# EAGLE schematic Netzteil_Darlington_v2 (EAGLE 8.6.3)

## Sheet 1 of 3
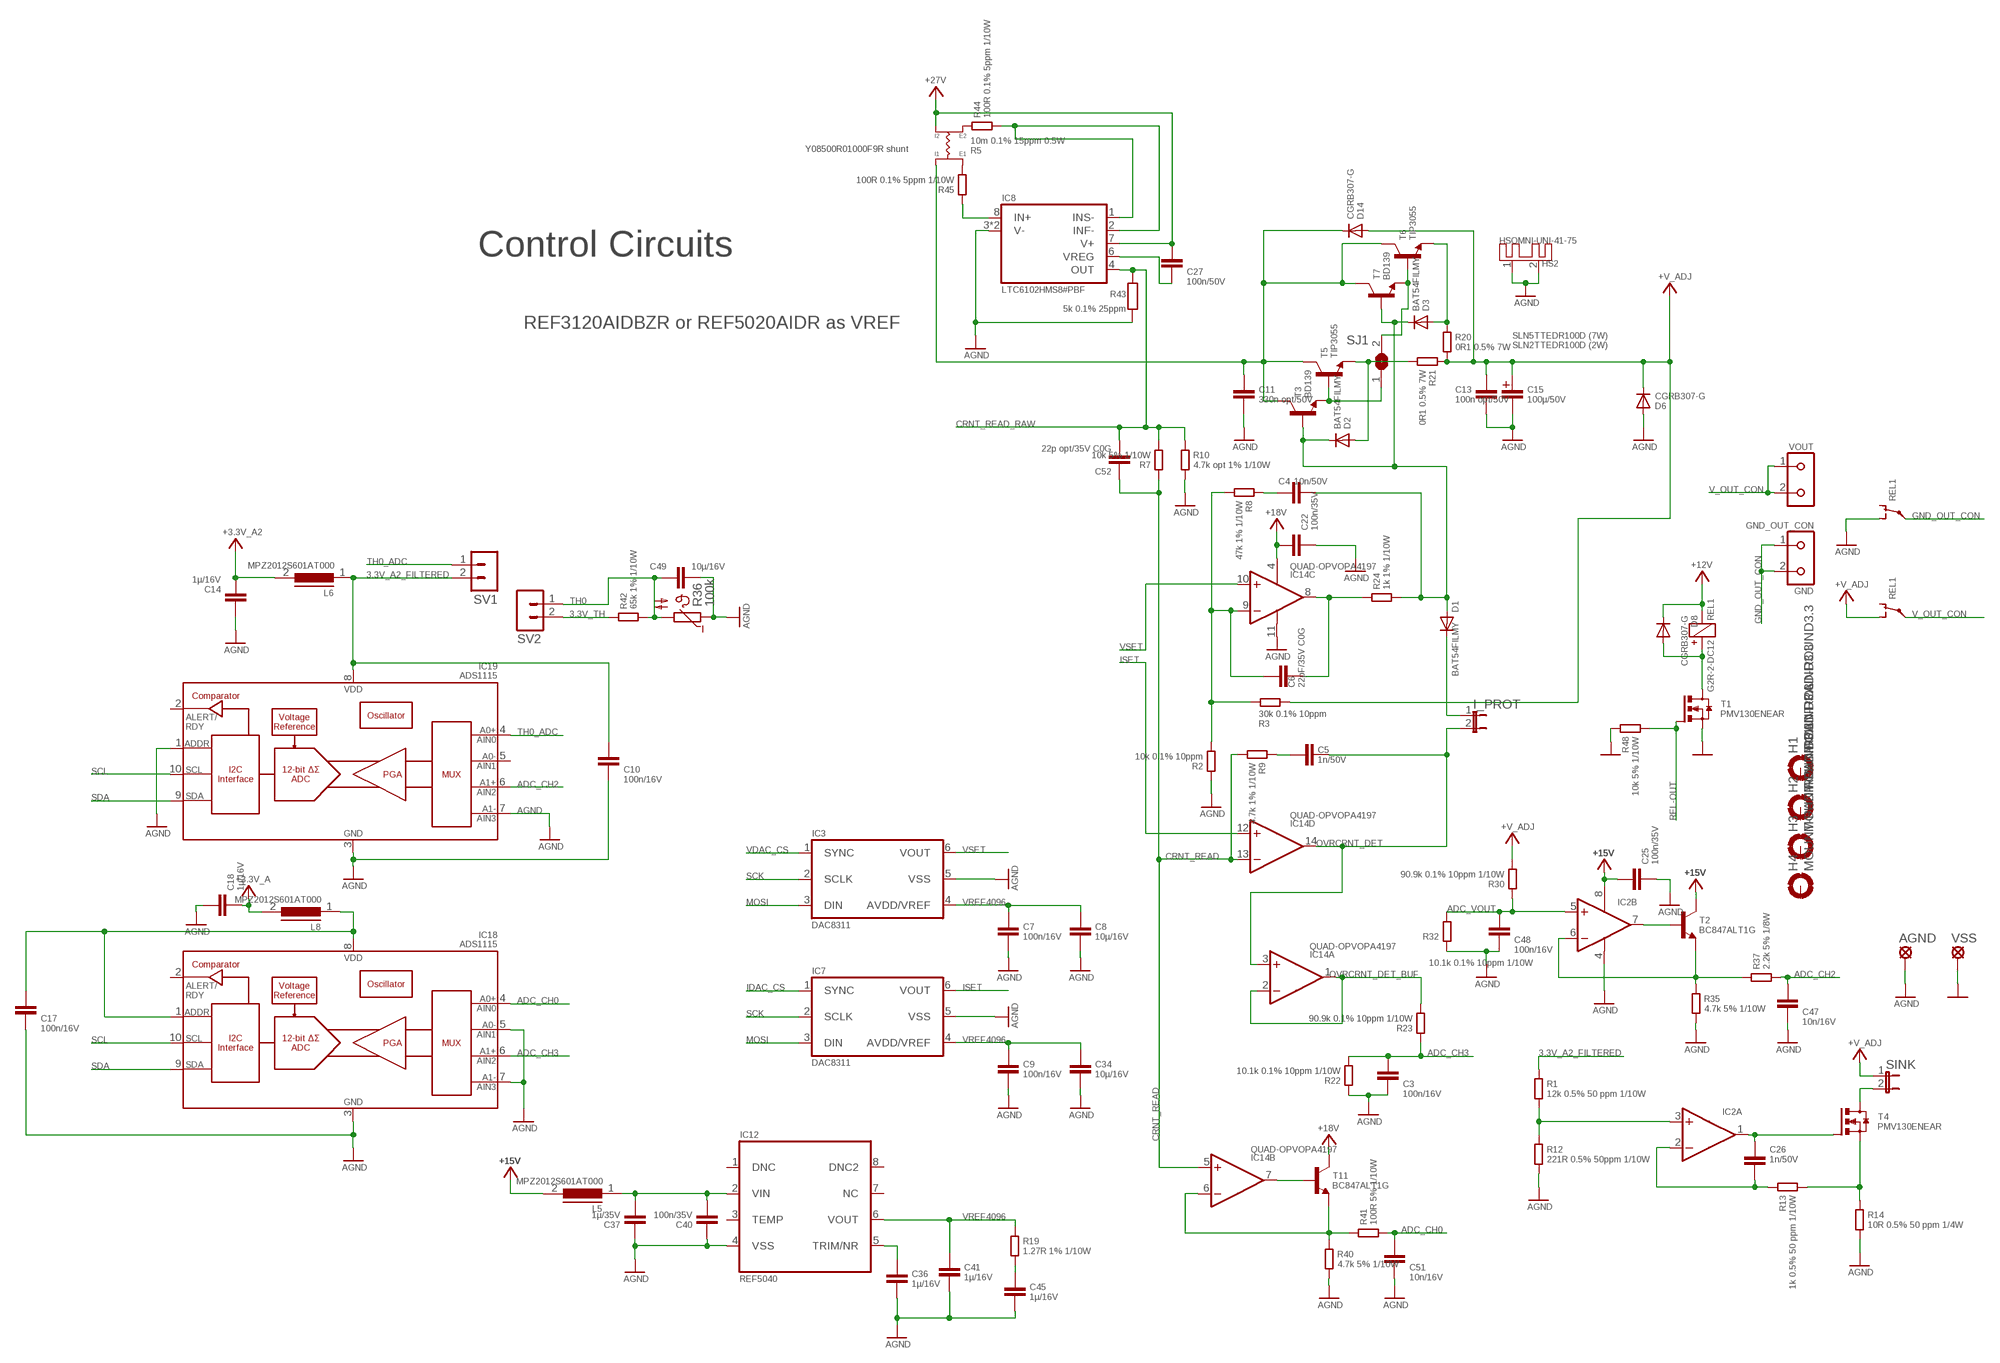
[diagram p0: schematic, sheet 1]

### Parts
AGND  LSP13  [LSP13]
C3  100n/16V  CC/0805  [0805]
C4  10n/50V  CC/0805  [0805]
C5  1n/50V  CC/0805  [0805]
C6  22pF/35V C0G  CC/0805  [0805]
C7  100n/16V  CC/0805  [0805]
C8  10µ/16V  CC/1206  [1206]
C9  100n/16V  CC/0805  [0805]
C10  100n/16V  CC/0805  [0805]
C11  330n opt/50V  CC/0805  [0805]
C13  100n opt/50V  CC/0805  [0805]
C14  1µ/16V  CC/0805  [0805]
C15  100µ/50V  C+3.5/8  [C+/3.5/8]
C17  100n/16V  CC/0805  [0805]
C18  1µ/16V  CC/0805  [0805]
C22  100n/35V  CC/0805  [0805]
C25  100n/35V  CC/0805  [0805]
C26  1n/50V  CC/0805  [0805]
C27  100n/50V  CC/0805  [0805]
C34  10µ/16V  CC/1206  [1206]
C36  1µ/16V  CC/0805  [0805]
C37  1µ/35V  CC/0805  [0805]
C40  100n/35V  CC/0805  [0805]
C41  1µ/16V  CC/0805  [0805]
C45  1µ/16V  CC/0805  [0805]
C47  10n/16V  CC/0805  [0805]
C48  100n/16V  CC/0805  [0805]
C49  10µ/16V  CC/1206  [1206]
C51  10n/16V  CC/0805  [0805]
C52  22p opt/35V C0G  CC/0805  [0805]
D1  BAT54FILMY  DBAT54FILMY  [SOT23]
D2  BAT54FILMY  DBAT54FILMY  [SOT23]
D3  BAT54FILMY  DBAT54FILMY  [SOT23]
D6  CGRB307-G  DWIDE  [DO214AA-CGRB307-G]
D8  CGRB307-G  DWIDE  [DO214AA-CGRB307-G]
D14  CGRB307-G  DWIDE  [DO214AA-CGRB307-G]
GND_OUT_CON  GND  KL2691311500002  [KL2-691311500002]
H1  MOUNT-PAD-ROUND3.3  [3,3-PAD]
H2  MOUNT-PAD-ROUND3.3  [3,3-PAD]
H3  MOUNT-PAD-ROUND3.3  [3,3-PAD]
H4  MOUNT-PAD-ROUND3.3  [3,3-PAD]
HS2  HSOMNI-UNI-41-75  [OMNI-UNI-41-75]
I_PROT  JP1E  [JP1]
IC2  DUAL-OPVSOP8  [SOP8]
IC3  DAC8311  DAC8X11  [SC-70-6]
IC7  DAC8311  DAC8X11  [SC-70-6]
IC8  LTC6102HMS8#PBF  LTC6102  [MSOP8-0.65-3X3MM]
IC12  REF5040  REF50XXVSSOP8  [MSOP8-0.65-3X3MM]
IC14  QUAD-OPVOPA4197  [SO14]
IC18  ADS1115  ADS1015  [MSOP10]
IC19  ADS1115  ADS1015  [MSOP10]
L5  MPZ2012S601AT000  L0805  [C0805K]
L6  MPZ2012S601AT000  L0805  [C0805K]
L8  MPZ2012S601AT000  L0805  [C0805K]
R1  12k 0.5% 50 ppm 1/10W  R-SMD0805  [C0805K]
R2  10k 0.1% 10ppm  R-SMD0805  [C0805K]
R3  30k 0.1% 10ppm  R-SMD0805  [C0805K]
R5  10m 0.1% 15ppm 0.5W  R-CSM2512  [CSM2512]
R7  10k 5% 1/10W  R-SMD0805  [C0805K]
R8  47k 1% 1/10W  R-SMD0805  [C0805K]
R9  4.7k 1% 1/10W  R-SMD0805  [C0805K]
R10  4.7k opt 1% 1/10W  R-SMD0805  [C0805K]
R12  221R 0.5% 50ppm 1/10W  R-SMD0805  [C0805K]
R13  1k 0.5% 50 ppm 1/10W  R-SMD0805  [C0805K]
R14  10R 0.5% 50 ppm 1/4W  R-SMD0805  [C0805K]
R19  1.27R 1% 1/10W  R-SMD0805  [C0805K]
R20  0R1 0.5% 7W  R-SMDSLN2  [SLN2]
R21  0R1 0.5% 7W  R-SMDSLN2  [SLN2]
R22  10.1k 0.1% 10ppm 1/10W  R-SMD0805  [C0805K]
R23  90.9k 0.1% 10ppm 1/10W  R-SMD0805  [C0805K]
R24  1k 1% 1/10W  R-SMD0805  [C0805K]
R30  90.9k 0.1% 10ppm 1/10W  R-SMD0805  [C0805K]
R32  10.1k 0.1% 10ppm 1/10W  R-SMD0805  [C0805K]
R35  4.7k 5% 1/10W  R-SMD0805  [C0805K]
R36  100k  NTC640  [P640]
R37  2.2k 5% 1/8W  R-SMD0805  [C0805K]
R40  4.7k 5% 1/10W  R-SMD0805  [C0805K]
R41  100R 5% 1/10W  R-SMD0805  [C0805K]
R42  65k 1% 1/10W  R-SMD0805  [C0805K]
R43  5k 0.1% 25ppm  R-EU_R1206  [R1206]
R44  100R 0.1% 5ppm 1/10W  R-SMD0805  [C0805K]
R45  100R 0.1% 5ppm 1/10W  R-SMD0805  [C0805K]
R48  10k 5% 1/10W  R-SMD0805  [C0805K]
REL1  G2R-2-DC12  REL-2UG2R2  [REL-G2R2]
SINK  JP1E  [JP1]
SJ1  SJ  [SJ]
SV1  JST-PH-2.0-2P  [JST-PH-2.0-2P]
SV2  JST-PH-2.0-2P  [JST-PH-2.0-2P]
T1  PMV130ENEAR  T-NMOSIRLML2502PBF  [SOT23]
T2  BC847ALT1G  T-NPNSOT23-BEC  [SOT23-BEC]
T3  BD139  T-NPNTO126-ECB  [TO126]
T4  PMV130ENEAR  T-NMOSIRLML2502PBF  [SOT23]
T5  TIP3055  T-NPNTOP3AV-BCE  [TOP3AV]
T6  TIP3055  T-NPNTOP3AV-BCE  [TOP3AV]
T7  BD139  T-NPNTO126-ECB  [TO126]
T11  BC847ALT1G  T-NPNSOT23-BEC  [SOT23-BEC]
VOUT  KL2691311500002  [KL2-691311500002]
VSS  LSP13  [LSP13]

### Nets
3.3V_A2_FILTERED: C10.1 IC19.8(VDD) L6.1 R1.1 SV1.2
3.3V_TH: R42.1 SV2.2
+3.3V_A: C18.2 L8.2 ; also sheet 2
+3.3V_A2: C14.2 L6.2 ; also sheet 2
+12V: D8.C REL1.-(1:-) ; also sheet 2,3
+15V: C25.1 IC2.8(PWR:V+) L5.2 T2.C ; also sheet 2
+18V: C22.1 IC14.4(PWR:V+) T11.C ; also sheet 2
+27V: C27.1 IC8.7(V+) R5.I2 ; also sheet 2
+V_ADJ: C13.1 C15.+ D6.C D14.A R3.1 R20.2 R21.1 R30.2 REL1.S1(2:S) SINK.1
ADC_CH0: C51.1 IC18.4(AIN0) R41.2
ADC_CH2: C47.1 IC19.6(AIN2) R37.2
ADC_CH3: C3.1 IC18.6(AIN2) R22.2 R23.1
ADC_VOUT: C48.1 IC2.5(B:+IN) R30.1 R32.2
AGND: AGND.MP C3.2 C7.2 C8.2 C9.2 C10.2 C11.2 C13.2 C14.1 C15.- C17.2 C18.1 C22.2 C25.2 C34.2 C36.2 C37.1 C40.1 C41.2 C45.2 C47.2 C48.2 C49.1 C51.2 D6.A HS2.1 HS2.2 IC2.4(PWR:V-) IC3.5(VSS) IC7.5(VSS) IC8.3(V-) IC8.5(V-) IC12.4(VSS) IC14.11(PWR:V-) IC18.3(VSS) IC18.5(AIN1) IC18.7(AIN3) IC19.1(ADDR) IC19.3(VSS) IC19.7(AIN3) R2.1 R10.2 R12.2 R14.2 R22.1 R32.1 R35.2 R36.1 R40.2 R43.1 REL1.S2(3:S) ; also sheet 2,3
CRNT_READ: C52.1 IC14.5(B:+IN) IC14.13(D:-IN) R7.1 R9.2
CRNT_READ_RAW: C52.2 IC8.4(OUT) R7.2 R10.1 R43.2
GND_OUT_CON: GND_OUT_CON.1 GND_OUT_CON.2 REL1.P2(3:P)
IDAC_CS: IC7.1(SYNC) ; also sheet 3
ISET: IC7.6(VOUT) IC14.12(D:+IN)
MOSI: IC3.3(DIN) IC7.3(DIN) ; also sheet 3
N$3: C11.1 D14.C R5.I1 T3.2(C) T5.C T6.C T7.2(C)
N$4: D3.1(A) R20.1 T6.E
N$5: SJ1.2 T6.B T7.1(E)
N$6: IC14.7(B:OUT) T11.B
N$8: D2.1(A) R21.2 T5.E
N$10: D1.3(C) I_PROT.1
N$11: IC2.3(A:+IN) R1.2 R12.1
N$14: C36.1 IC12.5(TRIM/NR)
N$15: SJ1.1 T3.1(E) T5.B
N$16: R13.2 R14.1 T4.2(S)
N$18: C26.2 IC2.2(A:-IN) R13.1
N$19: IC2.7(B:OUT) T2.B
N$21: C6.2 IC14.8(C:OUT) R24.1
N$22: C4.2 D1.1(A) D2.3(C) D3.3(C) R24.2 T3.3(B) T7.3(B)
N$24: C17.1 IC18.1(ADDR) IC18.8(VDD) L8.1
N$25: C37.2 C40.2 IC12.2(VIN) L5.1
N$27: C4.1 R8.1
N$28: C5.1 R9.1
N$31: C6.1 IC14.9(C:-IN) R2.2 R3.2 R8.2
N$32: C45.1 R19.2
N$33: C26.1 IC2.1(A:OUT) T4.1(G)
N$34: SINK.2 T4.3(D)
N$38: D8.A REL1.+(1:+) T1.3(D)
N$41: IC2.6(B:-IN) R35.1 R37.1 T2.E
N$45: IC14.6(B:-IN) R40.1 R41.1 T11.E
N$47: IC8.8(IN+) R45.1
N$49: IC8.1(INS-) IC8.2(INF-) R44.2
N$50: C27.2 IC8.6(VREG)
N$51: R5.E2 R44.1
N$52: R5.E1 R45.2
OVRCRNT_DET: C5.2 I_PROT.2 IC14.3(A:+IN) IC14.14(D:OUT)
OVRCRNT_DET_BUF: IC14.1(A:OUT) IC14.2(A:-IN) R23.2
REL-OUT: R48.2 T1.1(G) ; also sheet 3
SCK: IC3.2(SCLK) IC7.2(SCLK) ; also sheet 3
SCL: IC18.10(SCL) IC19.10(SCL) ; also sheet 3
SDA: IC18.9(SDA) IC19.9(SDA) ; also sheet 3
TH0: C49.2 R36.2 R42.2 SV2.1
TH0_ADC: IC19.4(AIN0) SV1.1
V_OUT_CON: REL1.P1(2:P) VOUT.1 VOUT.2
VDAC_CS: IC3.1(SYNC) ; also sheet 3
VREF4096: C7.1 C8.1 C9.1 C34.1 C41.1 IC3.4(AVDD/VREF) IC7.4(AVDD/VREF) IC12.6(VOUT) R19.1
VSET: IC3.6(VOUT) IC14.10(C:+IN)
VSS: R48.1 T1.2(S) VSS.MP ; also sheet 2,3
Unconnected: H1.B3,3(MOUNT) H2.B3,3(MOUNT) H3.B3,3(MOUNT) H4.B3,3(MOUNT) IC12.1(DNC) IC12.3(TEMP) IC12.7(NC) IC12.8(DNC2) IC18.2(ALERT/RDY) IC19.2(ALERT/RDY) IC19.5(AIN1) REL1.O1(2:O) REL1.O2(3:O)

### Notes on the sheet
- Y08500R01000F9R shunt
- Control Circuits
- REF3120AIDBZR or REF5020AIDR as VREF
- SLN5TTEDR100D (7W)
  SLN2TTEDR100D (2W)

## Sheet 2 of 3
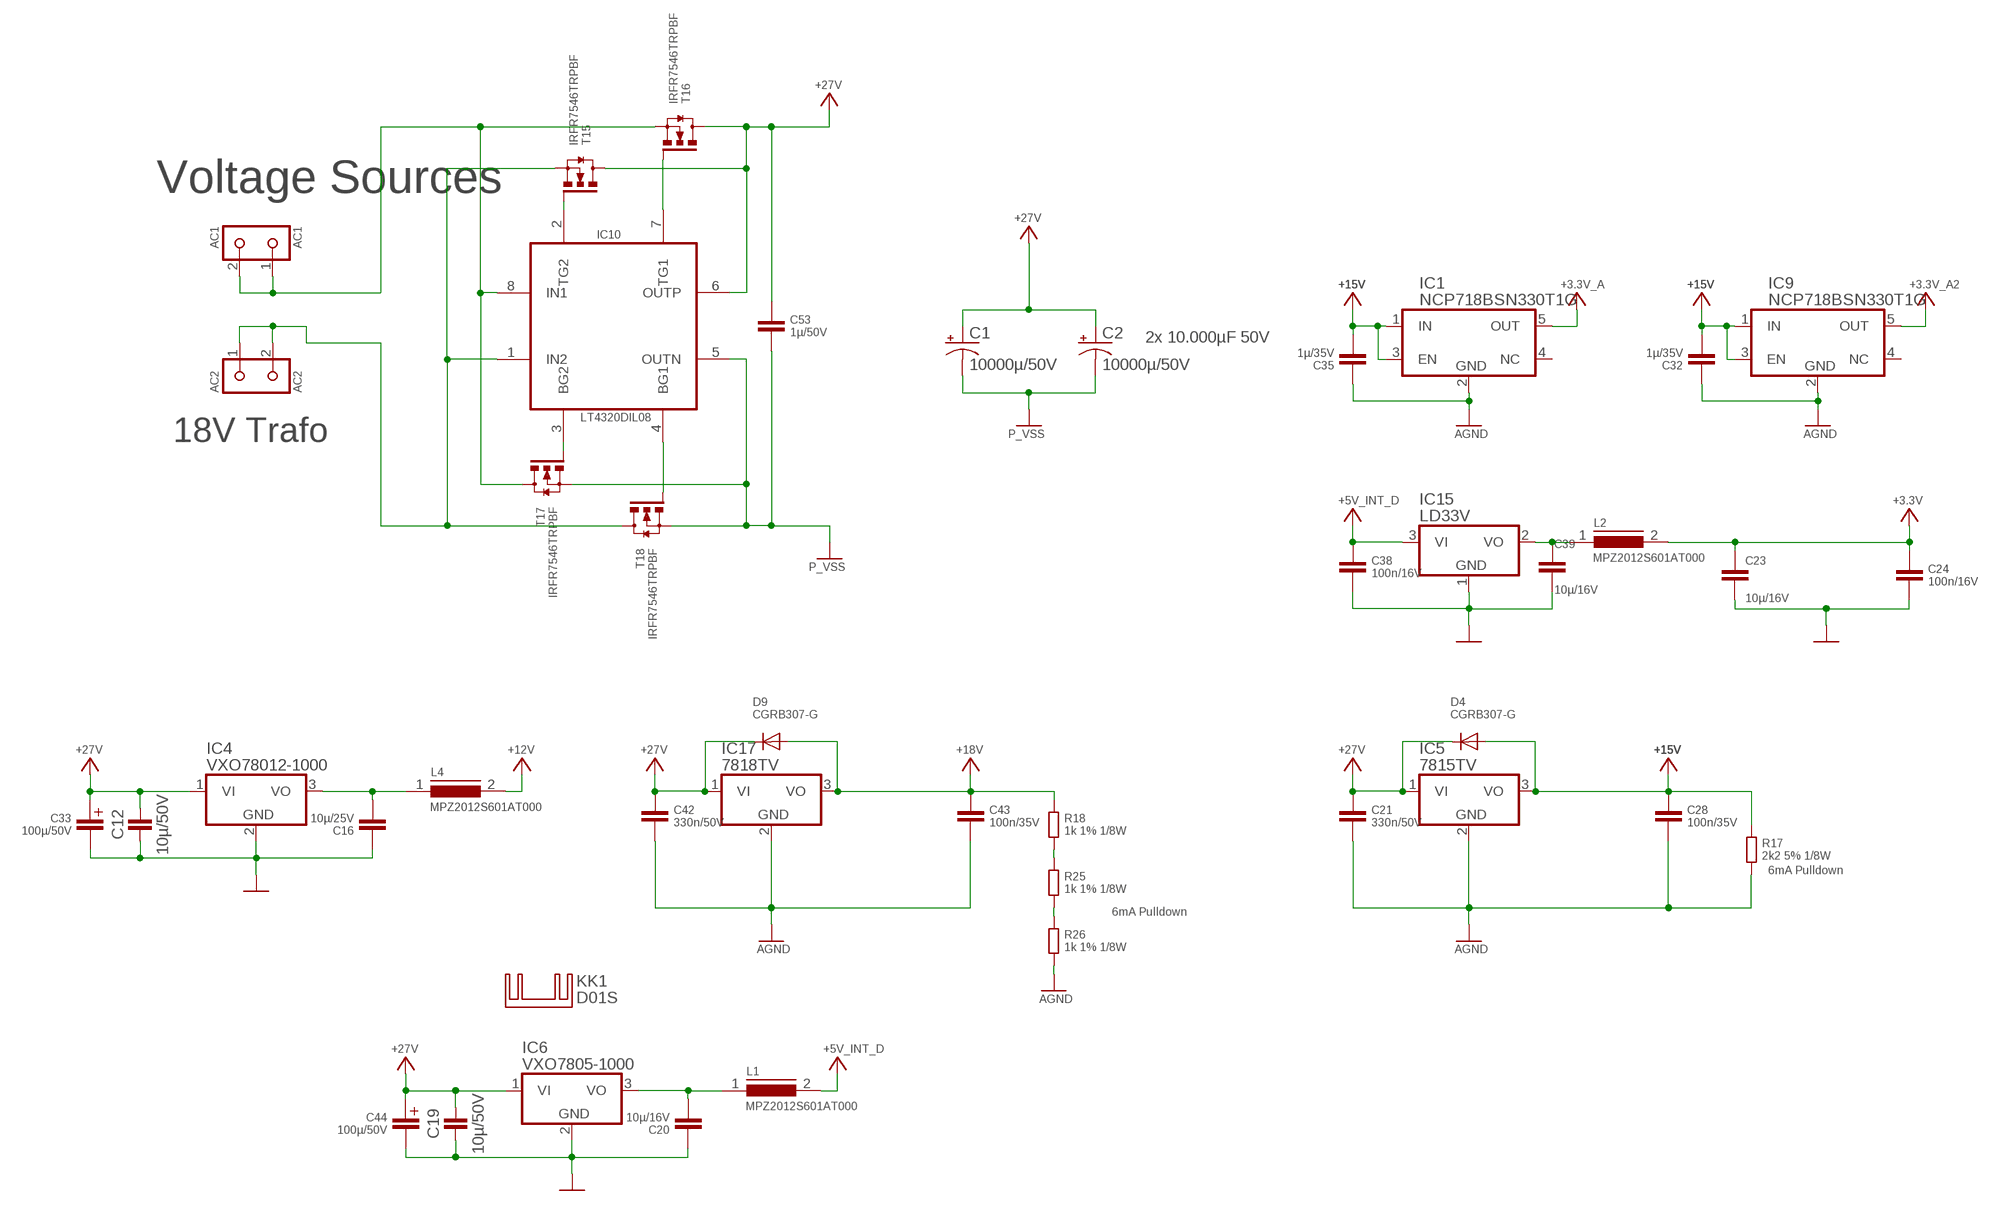
[diagram p1: schematic, sheet 2]

### Parts
AC1  AC1  KL2691311500002  [KL2-691311500002]
AC2  AC2  KL2691311500002  [KL2-691311500002]
C1  10000µ/50V  CPOL-USE10-22.5  [EB22,5D]
C2  10000µ/50V  CPOL-USE10-22.5  [EB22,5D]
C12  10µ/50V  CAPACITOR-1210  [C1210]
C16  10µ/25V  CC/1206  [1206]
C19  10µ/50V  CAPACITOR-1210  [C1210]
C20  10µ/16V  CC/1206  [1206]
C21  330n/50V  CC/0805  [0805]
C23  10µ/16V  CC/1206  [1206]
C24  100n/16V  CC/0805  [0805]
C28  100n/35V  CC/0805  [0805]
C32  1µ/35V  CC/0805  [0805]
C33  100µ/50V  C+3.5/8  [C+/3.5/8]
C35  1µ/35V  CC/0805  [0805]
C38  100n/16V  CC/0805  [0805]
C39  10µ/16V  CC/1206  [1206]
C42  330n/50V  CC/0805  [0805]
C43  100n/35V  CC/0805  [0805]
C44  100µ/50V  C+3.5/8  [C+/3.5/8]
C53  1µ/50V  CC/1206  [1206]
D4  CGRB307-G  DWIDE  [DO214AA-CGRB307-G]
D9  CGRB307-G  DWIDE  [DO214AA-CGRB307-G]
IC1  NCP718BSN330T1G  NCP718  [SOT23-5]
IC4  VXO78012-1000  78XX-DC-DC-UNI-VXO-OKI  [78XX-DC-DC]
IC5  7815TV  [TO220V]
IC6  VXO7805-1000  78XX-DC-DC-UNI-VXO-OKI  [78XX-DC-DC]
IC9  NCP718BSN330T1G  NCP718  [SOT23-5]
IC10  LT4320DIL08  [DIL08]
IC15  LD33V  [TO220V]
IC17  7818TV  [TO220V]
KK1  D01S  [D01S]
L1  MPZ2012S601AT000  L0805  [C0805K]
L2  MPZ2012S601AT000  L0805  [C0805K]
L4  MPZ2012S601AT000  L0805  [C0805K]
R17  2k2 5% 1/8W  R-SMD0805  [C0805K]
R18  1k 1% 1/8W  R-SMD0805  [C0805K]
R25  1k 1% 1/8W  R-SMD0805  [C0805K]
R26  1k 1% 1/8W  R-SMD0805  [C0805K]
T15  IRFR7546TRPBF  T-NMOSNTD4963N  [DPACK]
T16  IRFR7546TRPBF  T-NMOSNTD4963N  [DPACK]
T17  IRFR7546TRPBF  T-NMOSNTD4963N  [DPACK]
T18  IRFR7546TRPBF  T-NMOSNTD4963N  [DPACK]

### Nets
+3.3V: C23.1 C24.1 L2.2 ; also sheet 3
+3.3V_A: IC1.5(OUT) ; also sheet 1
+3.3V_A2: IC9.5(OUT) ; also sheet 1
+5V_INT_D: C38.1 IC15.3(VI) L1.2 ; also sheet 3
+12V: L4.2 ; also sheet 1,3
+15V: C28.1 C32.2 C35.2 D4.A IC1.1(IN) IC1.3(EN) IC5.3(VO) IC9.1(IN) IC9.3(EN) R17.1 ; also sheet 1
+18V: C43.1 D9.A IC17.3(VO) R18.1 ; also sheet 1
+27V: C1.+ C2.+ C12.2 C19.2 C21.1 C33.+ C42.1 C44.+ C53.1 D4.C D9.C IC4.1(VI) IC5.1(VI) IC6.1(VI) IC10.6(OUTP) IC17.1(VI) T15.3(D) T16.3(D) ; also sheet 1
AGND: C21.2 C28.2 C32.1 C35.1 C42.2 C43.2 IC1.2(GND) IC5.2(GND) IC9.2(GND) IC17.2(GND) R17.2 R26.2 ; also sheet 1,3
N$1: C20.2 IC6.3(VO) L1.1
N$2: AC2.1 AC2.2 IC10.1(IN2) T15.2(S) T18.3(D)
N$13: C16.2 IC4.3(VO) L4.1
N$26: R18.2 R25.1
N$30: R25.2 R26.1
N$35: C39.2 IC15.2(VO) L2.1
N$53: IC10.2(TG2) T15.1(G)
N$54: IC10.3(BG2) T17.1(G)
N$55: IC10.7(TG1) T16.1(G)
N$56: IC10.4(BG1) T18.1(G)
N$57: AC1.1 AC1.2 IC10.8(IN1) T16.2(S) T17.3(D)
P_VSS: C1.- C2.- C53.2 IC10.5(OUTN) T17.2(S) T18.2(S)
VSS: C12.1 C16.1 C19.1 C20.1 C23.2 C24.2 C33.- C38.2 C39.1 C44.- IC4.2(GND) IC6.2(GND) IC15.1(GND) ; also sheet 1,3
Unconnected: IC1.4(NC) IC9.4(NC)

### Notes on the sheet
- Voltage Sources
- 2x 10.000µF 50V
- 18V Trafo
- 6mA Pulldown
- 6mA Pulldown

## Sheet 3 of 3
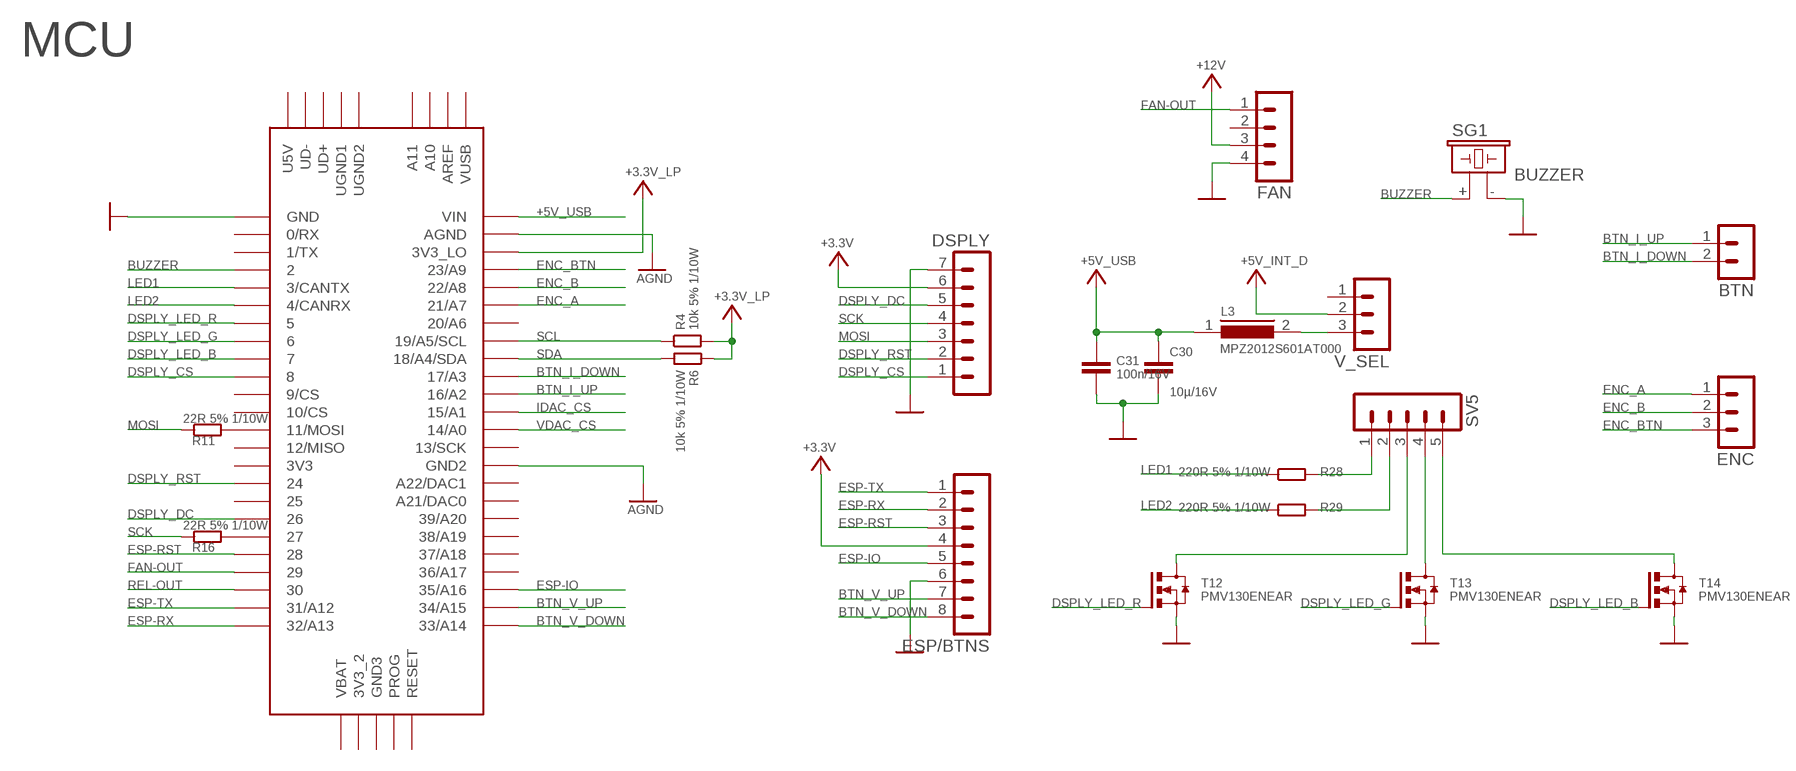
[diagram p2: schematic, sheet 3]

### Parts
BTN  JST-PH-2.0-2P  [JST-PH-2.0-2P]
C30  10µ/16V  CC/1206  [1206]
C31  100n/16V  CC/0805  [0805]
DSPLY  JST-PH-2.0-7P  [JST-PH-2.0-7P]
ENC  JST-PH-2.0-3P  [JST-PH-2.0-3P]
ESP/BTNS  JST-PH-2.0-8P  [JST-PH-2.0-8P]
FAN  JST-PH-2.0-4P  [JST-PH-2.0-4P]
L3  MPZ2012S601AT000  L0805  [C0805K]
R4  10k 5% 1/10W  R-SMD0805  [C0805K]
R6  10k 5% 1/10W  R-SMD0805  [C0805K]
R11  22R 5% 1/10W  R-SMD0805  [C0805K]
R16  22R 5% 1/10W  R-SMD0805  [C0805K]
R28  220R 5% 1/10W  R-SMD0805  [C0805K]
R29  220R 5% 1/10W  R-SMD0805  [C0805K]
SG1  BUZZER  [254-EMB73-RO]
SV5  JST-PH-2.0-5P  [JST-PH-2.0-5P]
T12  PMV130ENEAR  T-NMOSIRLML2502PBF  [SOT23]
T13  PMV130ENEAR  T-NMOSIRLML2502PBF  [SOT23]
T14  PMV130ENEAR  T-NMOSIRLML2502PBF  [SOT23]
U$33  TEENSY_3.5/3.6  [TEENSY_3.5/3.6]
V_SEL  MA03-1  [MA03-1]

### Nets
+3.3V: DSPLY.6 ESP/BTNS.4 ; also sheet 2
+3.3V_LP: R4.2 R6.1 U$33.3V3_LO
+5V_INT_D: V_SEL.2 ; also sheet 2
+5V_USB: C30.1 C31.1 L3.1 U$33.VIN
+12V: FAN.3 ; also sheet 1,2
AGND: U$33.AGND U$33.GND2 ; also sheet 1,2
BTN_I_DOWN: BTN.2 U$33.17/A3
BTN_I_UP: BTN.1 U$33.16/A2
BTN_V_DOWN: ESP/BTNS.8 U$33.33/A14
BTN_V_UP: ESP/BTNS.7 U$33.34/A15
BUZZER: SG1.+ U$33.2
DSPLY_CS: DSPLY.1 U$33.8
DSPLY_DC: DSPLY.5 U$33.26
DSPLY_LED_B: T14.1(G) U$33.7
DSPLY_LED_G: T13.1(G) U$33.6
DSPLY_LED_R: T12.1(G) U$33.5
DSPLY_RST: DSPLY.2 U$33.24
ENC_A: ENC.1 U$33.21/A7
ENC_B: ENC.2 U$33.22/A8
ENC_BTN: ENC.3 U$33.23/A9
ESP-IO: ESP/BTNS.5 U$33.35/A16
ESP-RST: ESP/BTNS.3 U$33.28
ESP-RX: ESP/BTNS.2 U$33.32/A13
ESP-TX: ESP/BTNS.1 U$33.31/A12
FAN-OUT: FAN.1 U$33.29
IDAC_CS: U$33.15/A1 ; also sheet 1
LED1: R28.1 U$33.3/CANTX
LED2: R29.1 U$33.4/CANRX
MOSI: DSPLY.3 R11.1 ; also sheet 1
N$7: SV5.3 T12.3(D)
N$9: R16.2 U$33.27
N$17: R11.2 U$33.11/MOSI
N$20: R28.2 SV5.1
N$23: R29.2 SV5.2
N$36: L3.2 V_SEL.3
N$46: SV5.4 T13.3(D)
N$48: SV5.5 T14.3(D)
REL-OUT: U$33.30 ; also sheet 1
SCK: DSPLY.4 R16.1 ; also sheet 1
SCL: R4.1 U$33.19/A5/SCL ; also sheet 1
SDA: R6.2 U$33.18/A4/SDA ; also sheet 1
VDAC_CS: U$33.14/A0 ; also sheet 1
VSS: C30.2 C31.2 DSPLY.7 ESP/BTNS.6 FAN.4 SG1.- T12.2(S) T13.2(S) T14.2(S) U$33.GND ; also sheet 1,2
Unconnected: FAN.2 U$33.0/RX U$33.1/TX U$33.3V3 U$33.3V3_2 U$33.9/CS U$33.10/CS U$33.12/MISO U$33.13/SCK U$33.20/A6 U$33.21/DAC0(A21/DAC0) U$33.25 U$33.36/A17 U$33.37/A18 U$33.38/A19 U$33.39/A20 U$33.A10 U$33.A11 U$33.A22/DAC1 U$33.AREF U$33.GND3 U$33.PROG U$33.RESET U$33.U5V U$33.UD+ U$33.UD- U$33.UGND1 U$33.UGND2 U$33.VBAT U$33.VUSB V_SEL.1

### Notes on the sheet
- MCU

## Library data of the parts
AC1 = neumluc:KL2: Printklemme 2-polig; OC_MOUSER: 710-691311500002; OC_MOUSER_ADD: 693-8601.2001.08; OC_MOUSER_ADD2: 693-3101.0010
AC2 = neumluc:KL2: Printklemme 2-polig; OC_MOUSER: 710-691311500002; OC_MOUSER_ADD: 693-8601.2001.08
AGND VSS = solpad:LSP13: SOLDER PAD drill 1.3 mm, distributor Buerklin, 12H562
BTN SV1 SV2 = neumluc:JST-PH-2.0-2P: PIN HEADER
C1 C2 = neumluc:CPOL-US: POLARIZED CAPACITOR, American symbol; OC_MOUSER: 647-UVZ1H103MRD
C3 C7 C9 C10 C13 C17 C22 C24 C25 C27 C28 C31 C38 C40 C43 C48 = goujine:C: Kondensator; OC_MOUSER: 810-C2012X7R2A104K
C4 C47 C51 = goujine:C: Kondensator; OC_MOUSER: 80-C0805C103K1R
C5 C26 = goujine:C: Kondensator; OC_MOUSER: 603-CC805KRX7R0BB102
C6 C52 = goujine:C: Kondensator; OC_MOUSER: 603-CC805JRNPO9BN220
C8 C16 C20 C23 C30 C34 C39 C49 = goujine:C: Kondensator; OC_MOUSER: 963-TMK316AB7106KL-T
C11 C21 C42 = goujine:C: Kondensator; OC_MOUSER: 80-C0805C334K5RECTU
C12 C19 = we-rcl:CAPACITOR: Capacitors ...2.2uF @ 6.3V -> 0402 ...4.7uF @ 6.3V -> 0603 ...10uF @ 16V -> 0805 ...22uF @ 25V -> 1206; OC_MOUSER: 81-GRM32ER71H106MA2L
C14 C18 C32 C35-C37 C41 C45 = goujine:C: Kondensator; OC_MOUSER: 963-UMK212B7105KG-T
C15 C33 C44 = goujine:C+; OC_MOUSER: 667-EEU-FR1H101
C53 = goujine:C: Kondensator; OC_MOUSER: 603-CC126KKX7R9BB105
D1-D3 = neumluc:D; OC_MOUSER: 511-BAT54FILMY
D4 D6 D8 D9 D14 = neumluc:D; OC_MOUSER: 750-CGRB307-G
DSPLY = neumluc:JST-PH-2.0-7P: PIN HEADER
ENC = neumluc:JST-PH-2.0-3P: PIN HEADER
ESP/BTNS = neumluc:JST-PH-2.0-8P: PIN HEADER
FAN = neumluc:JST-PH-2.0-4P: PIN HEADER
GND_OUT_CON = neumluc:KL2: Printklemme 2-polig; OC_MOUSER: 710-691311500002
H1-H4 = holes:MOUNT-PAD-ROUND: MOUNTING PAD, round
HS2 = neumluc:HS; OC_MOUSER: 567-OMNI-UNI-41-75; OC_MOUSER_ADD: 567-OMNI-UC; OC_MOUSER_ADD2: 567-CD-02-05-247
I_PROT SINK = jumper:JP1E: JUMPER
IC1 IC9 = neumluc:NCP718; OC_MOUSER: 863-NCP718BSN330T1G
IC2 = goujine:DUAL-OPV
IC3 IC7 = neumluc:DAC8X11; OC_MOUSER: 595-DAC8311IDCKR
IC4 = neumluc:78XX-DC-DC-UNI-VXO-OKI; OC_MOUSER: 490-VXO7812-1000
IC5 = linear:78*: Positive VOLTAGE REGULATOR Source: http://cache.national.com/ds/LM/LM78L05.pdf http://www.fairchildsemi.com/ds/LM/LM7805.pdf; OC_MOUSER: 511-L7815CV-DG
IC6 = neumluc:78XX-DC-DC-UNI-VXO-OKI; OC_MOUSER: 490-VXO7805-1000
IC8 = neumluc:LTC6102; OC_MOUSER: 584-LTC6102HMS8#PBF
IC10 = neumluc:LT4320; OC_MOUSER: 584-LT4320HN8-1#PBF
IC12 = neumluc:REF50XX; OC_MOUSER: 595-REF5040AIDGKR
IC14 = neumluc:QUAD-OPV
IC15 = neumluc:LD33V; OC_MOUSER: 511-LD1117V33
IC17 = linear:78*: Positive VOLTAGE REGULATOR Source: http://cache.national.com/ds/LM/LM78L05.pdf http://www.fairchildsemi.com/ds/LM/LM7805.pdf; OC_MOUSER: 511-L7818CV-DG
IC18 IC19 = neumluc:ADS1015: ADS1015 12-BIT ADC 12-Bit Del-Sig ADC Four single-ended inputs or two differential inputs Internal PGA I2C interface 2.0-5.5V SparkFun Products SparkFun Block for Intel Edison - ADC <https://www.sparkfun.com/products/13770> (DEV-13770); OC_MOUSER: 595-ADS1115IDGSR; PROD_ID: IC-12270; VALUE: ADS1015
KK1 = heatsink:D01S: HEATSINK distributor Schukat
L1-L6 L8 = neumluc:L: High Power Density, High Efficiency, Shielded Inductors; OC_MOUSER: 810-MPZ2012S601AT000
R1 = neumluc:R-SMD: R SMD; OC_MOUSER: 754-RR1220P-123D
R2 = neumluc:R-SMD: R SMD; OC_MOUSER: 667-ERA-6ARW103V
R3 = neumluc:R-SMD: R SMD; OC_MOUSER: 667-ERA-6ARW303V
R4 R6 R7 R48 = neumluc:R-SMD: R SMD; OC_MOUSER: 652-CR0805-JW-103ELF
R5 = neumluc:R-CSM2512; OC_MOUSER: 71-CSM25120R0100BST
R8 = neumluc:R-SMD: R SMD; OC_MOUSER: 652-CR0805FX-4702ELF
R9 R10 R35 R40 = neumluc:R-SMD: R SMD; OC_MOUSER: 652-CR0805FX-4701ELF
R11 R16 = neumluc:R-SMD: R SMD; OC_MOUSER: 652-CR0805JW-220ELF
R12 = neumluc:R-SMD: R SMD; OC_MOUSER: 754-RR1220P-2210D-M
R13 = neumluc:R-SMD: R SMD; OC_MOUSER: 754-RR1220P-102D
R14 = neumluc:R-SMD: R SMD; OC_MOUSER: 660-SG73G2ATTD10R0D
R17 = neumluc:R-SMD: R SMD; OC_MOUSER: 652-CR0805JW-222ELF
R18 R24-R26 = neumluc:R-SMD: R SMD; OC_MOUSER: 652-CR0805FX-1001ELF
R19 = neumluc:R-SMD: R SMD; OC_MOUSER: 71-CRCW08051R27FKEA
R20 R21 = neumluc:R-SMD: R SMD; OC_MOUSER: 66-SLN5TTED82L0D
R22 R32 = neumluc:R-SMD: R SMD; OC_MOUSER: 660-RN732ATTD1012B25
R23 R30 = neumluc:R-SMD: R SMD; OC_MOUSER: 279-RN73CA-90.9K
R28 R29 = neumluc:R-SMD: R SMD; OC_MOUSER: 652-CR0805FX-2200ELF
R36 = ptc-ntc:NTC640: PHILIPS NTC; OC_FARNELL: unknown; OC_MOUSER: 594-NTCLE213E3104HXB; OC_NEWARK: unknown
R37 R41 = neumluc:R-SMD: R SMD; OC_MOUSER: 652-CR0805JW-101ELF
R42 = neumluc:R-SMD: R SMD; OC_MOUSER: 652-CR0805FX-3903ELF
R43 = resistor:R-EU_: RESISTOR, European symbol; OC_MOUSER: 71-TNPW12065K00BEEN
R44 R45 = neumluc:R-SMD: R SMD; OC_MOUSER: 756-PCF080513100RBT1
REL1 = goujine:REL-2U; OC_MOUSER: 653-G2R-2-DC12
SG1 = neumluc:BUZZER: BUZZER Source: Buerklin; OC_FARNELL: unknown; OC_MOUSER: 254-EMB73-RO; OC_NEWARK: unknown
SJ1 = jumper:SJ: SMD solder JUMPER
SV5 = neumluc:JST-PH-2.0-5P: PIN HEADER
T1 T4 = neumluc:T-NMOS: Transistor N-Channel MOSFET; OC_MOUSER: 771-PMV130ENEAR
T2 T11 = neumluc:T-NPN: NPN Transistor; OC_MOUSER: 863-BC847ALT1G
T3 T7 = neumluc:T-NPN: NPN Transistor; OC_MOUSER: 511-BD139-10
T5 T6 = neumluc:T-NPN: NPN Transistor; OC_MOUSER: 863-TIP3055G
T12-T14 = goujine:T-NMOS: Transistor N-Channel MOSFET; OC_MOUSER: 771-PMV130ENEAR
T15-T18 = neumluc:T-NMOS: Transistor N-Channel MOSFET; OC_MOUSER: 942-IRFR7546TRPBF
U$33 = Teensy356:TEENSY_3.5/3.6; OC_MOUSER: 474-DEV-14055
V_SEL = con-lstb:MA03-1: PIN HEADER; OC_FARNELL: unknown; OC_NEWARK: unknown
VOUT = neumluc:KL2: Printklemme 2-polig; OC_MOUSER: 710-691311500002; OC_MOUSER_ADD: 565-72912-2; OC_MOUSER_ADD2: 565-6883